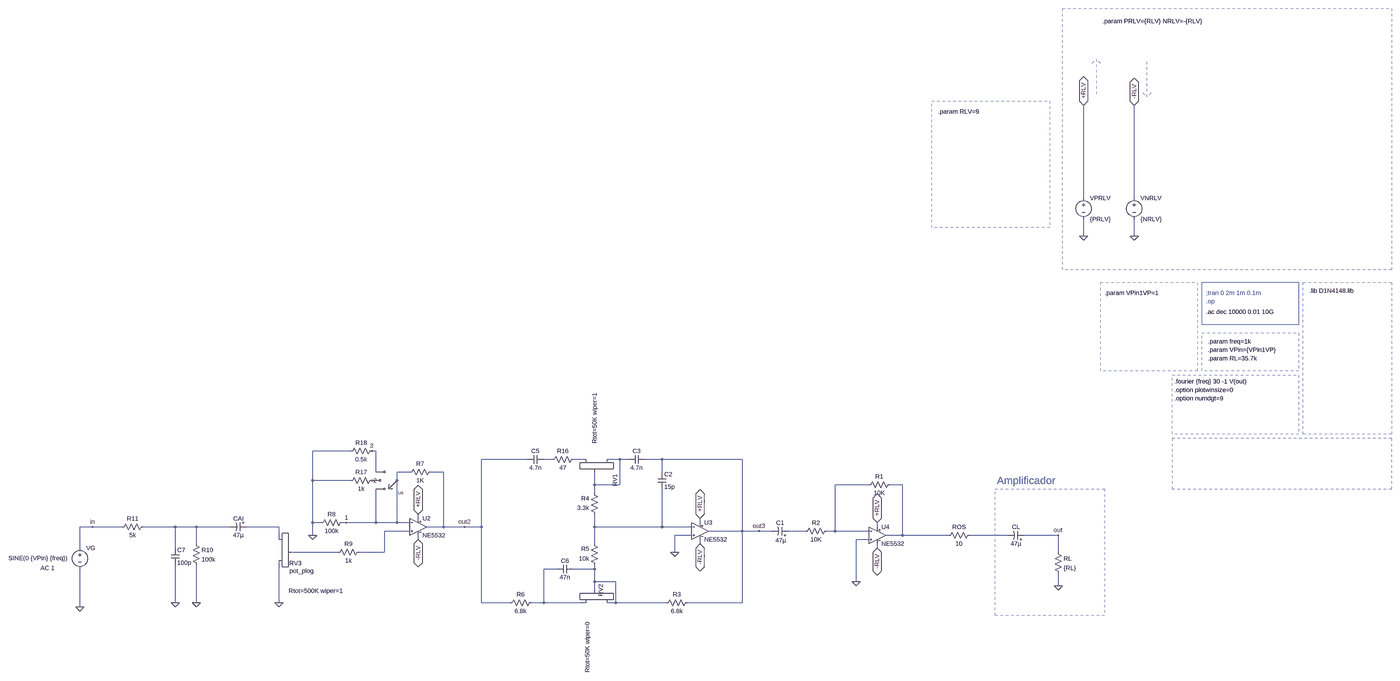
[diagram p0: schematic preamp_V0.4.asc, whole sheet]
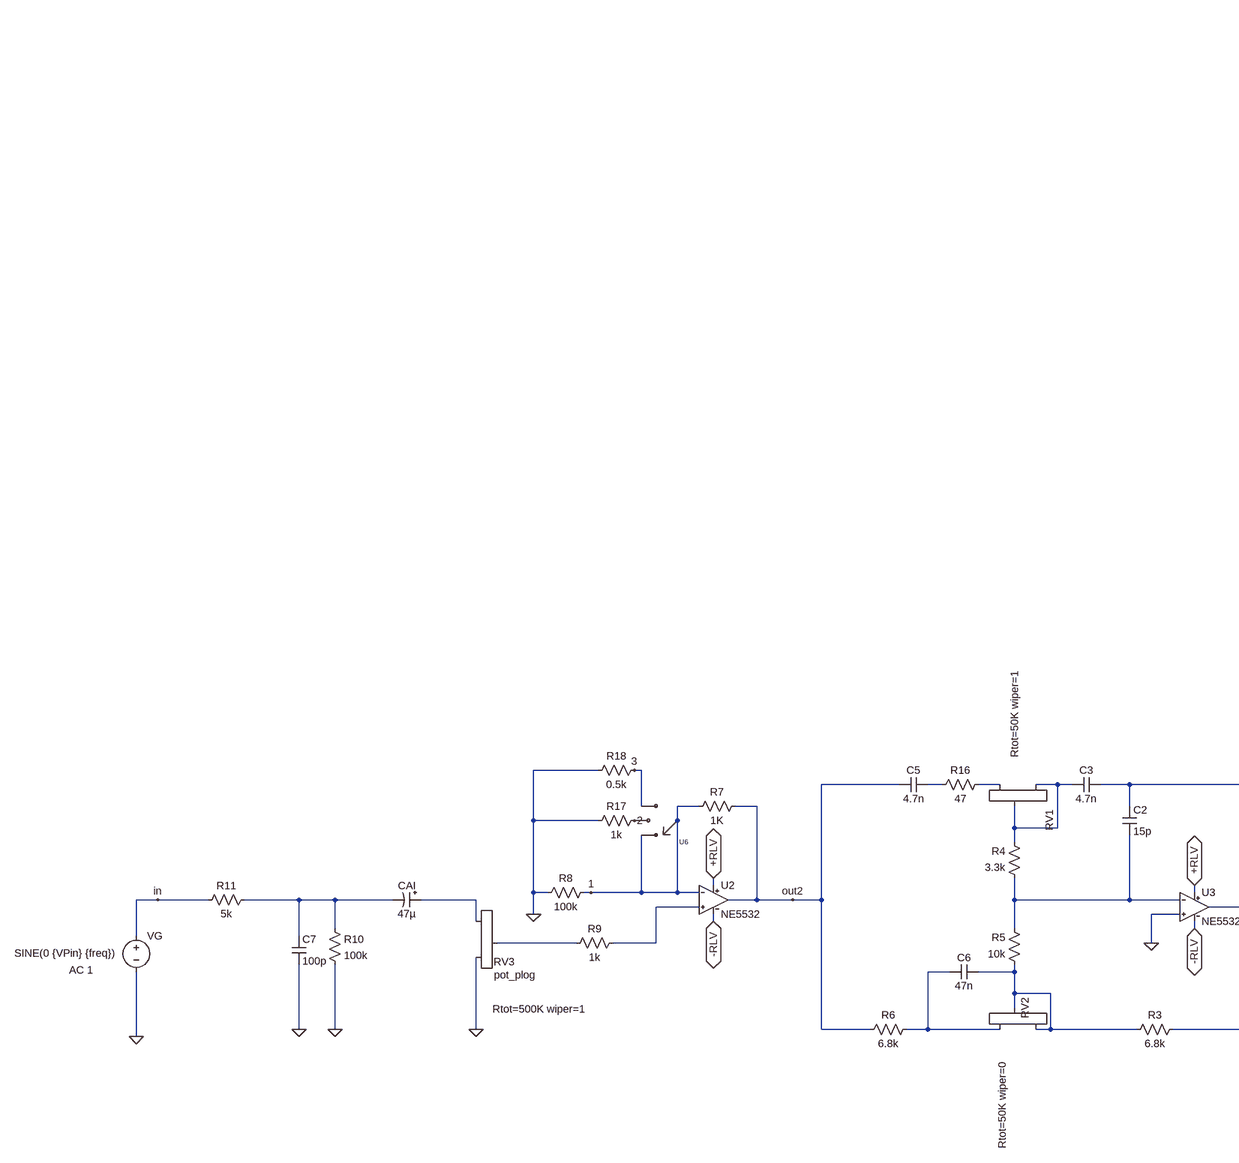
[diagram p1: schematic preamp_V0.4.asc, part, row 1 of 1, column 1 of 2]
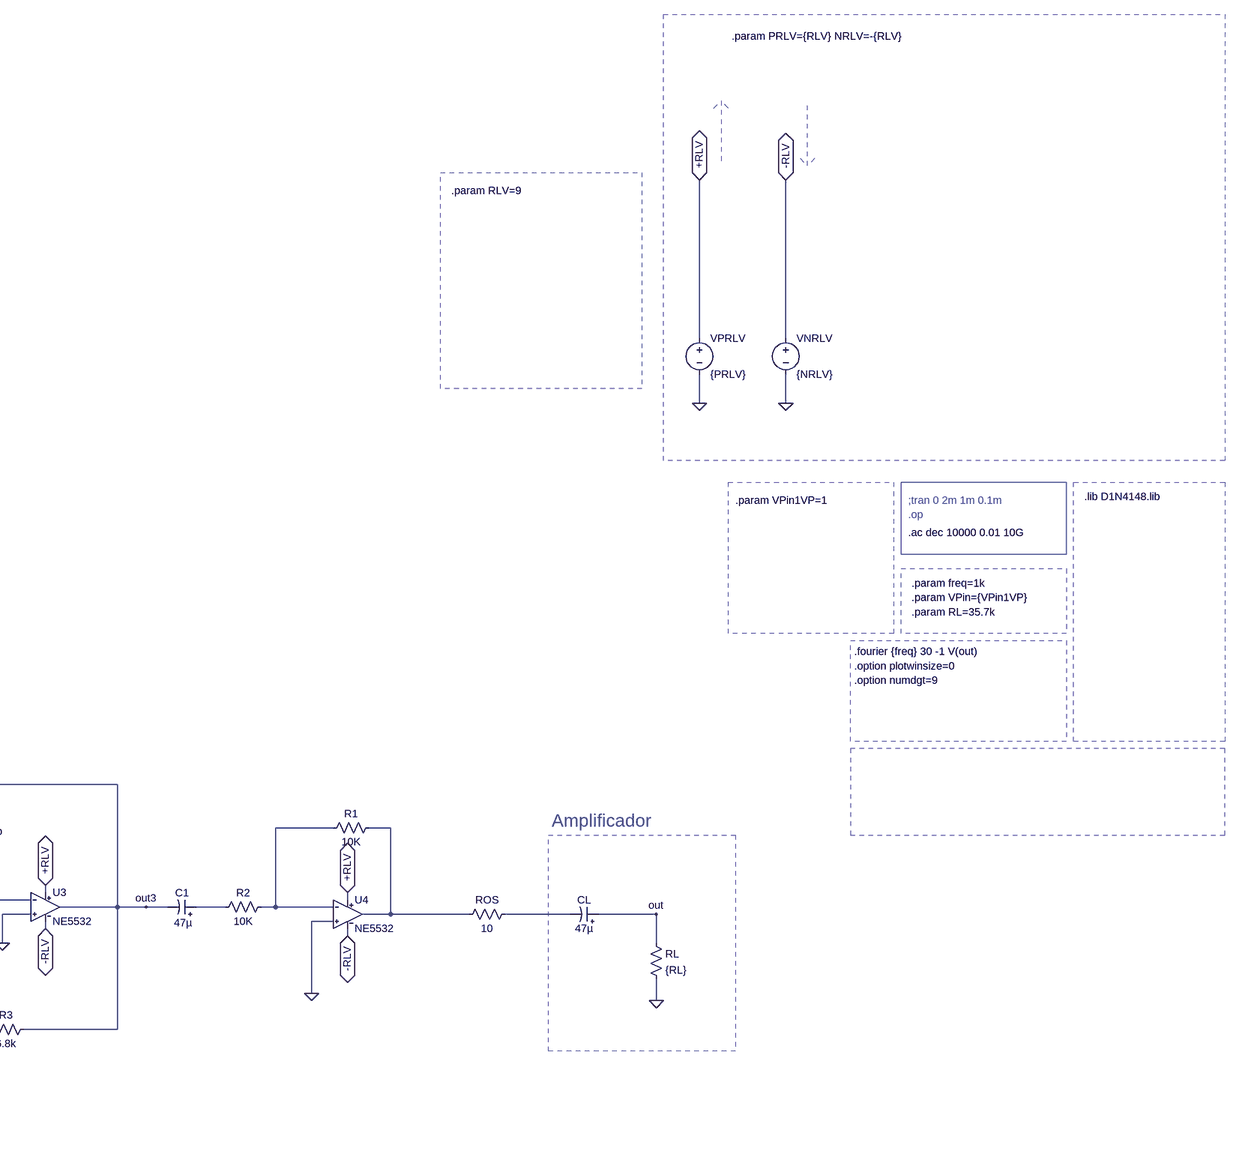
[diagram p2: schematic preamp_V0.4.asc, part, row 1 of 1, column 2 of 2]
preamp_V0.4.asc, the LTspice schematic file:
Version 4
SHEET 1 4212 2620
WIRE 1792 -1328 1792 -1680
WIRE 1984 -1328 1984 -1680
WIRE 1792 -1184 1792 -1248
WIRE 1984 -1184 1984 -1248
WIRE -992 -368 -1136 -368
WIRE -896 -368 -912 -368
WIRE -320 -336 -496 -336
WIRE -224 -336 -256 -336
WIRE -96 -336 -144 -336
WIRE 32 -336 -16 -336
WIRE 64 -336 32 -336
WIRE 192 -336 128 -336
WIRE 496 -336 192 -336
WIRE -896 -288 -896 -368
WIRE -768 -288 -816 -288
WIRE -640 -288 -688 -288
WIRE 192 -288 192 -336
WIRE -1136 -256 -1136 -368
WIRE -992 -256 -1136 -256
WIRE -816 -256 -816 -288
WIRE -64 -240 -64 -288
WIRE 32 -240 32 -336
WIRE 32 -240 -64 -240
WIRE 976 -240 848 -240
WIRE 1104 -240 1056 -240
WIRE -64 -208 -64 -240
WIRE -736 -112 -736 -128
WIRE -1136 -96 -1136 -256
WIRE -1104 -96 -1136 -96
WIRE -1008 -96 -1024 -96
WIRE -896 -96 -896 -224
WIRE -896 -96 -1008 -96
WIRE -816 -96 -816 -256
WIRE -816 -96 -896 -96
WIRE -768 -96 -816 -96
WIRE 336 -96 336 -112
WIRE -2064 -80 -2112 -80
WIRE -1872 -80 -2064 -80
WIRE -1664 -80 -1792 -80
WIRE -1584 -80 -1664 -80
WIRE -1456 -80 -1584 -80
WIRE -1264 -80 -1392 -80
WIRE -640 -80 -640 -288
WIRE -640 -80 -704 -80
WIRE -560 -80 -640 -80
WIRE -496 -80 -496 -336
WIRE -496 -80 -560 -80
WIRE -64 -80 -64 -128
WIRE 192 -80 192 -224
WIRE 192 -80 -64 -80
WIRE 304 -80 192 -80
WIRE 1008 -80 1008 -96
WIRE -768 -64 -864 -64
WIRE 496 -64 496 -336
WIRE 496 -64 368 -64
WIRE 560 -64 496 -64
WIRE 608 -64 560 -64
WIRE 736 -64 672 -64
WIRE 848 -64 848 -240
WIRE 848 -64 816 -64
WIRE 976 -64 848 -64
WIRE -1136 -48 -1136 -96
WIRE 304 -48 240 -48
WIRE 1104 -48 1104 -240
WIRE 1104 -48 1040 -48
WIRE 1280 -48 1104 -48
WIRE 1504 -48 1360 -48
WIRE 1696 -48 1568 -48
WIRE -1264 -32 -1264 -80
WIRE -736 -32 -736 -48
WIRE 976 -32 928 -32
WIRE -1584 -16 -1584 -80
WIRE -64 -16 -64 -80
WIRE 336 -16 336 -32
WIRE -2112 0 -2112 -80
WIRE -1664 0 -1664 -80
WIRE 1008 0 1008 -16
WIRE -1040 16 -1216 16
WIRE -864 16 -864 -64
WIRE -864 16 -960 16
WIRE 240 16 240 -48
WIRE 1696 16 1696 -48
WIRE -208 80 -256 80
WIRE -64 80 -64 64
WIRE -64 80 -144 80
WIRE -64 128 -64 80
WIRE 16 128 -64 128
WIRE 928 128 928 -32
WIRE 1696 144 1696 96
WIRE -64 160 -64 128
WIRE -1664 208 -1664 64
WIRE -1584 208 -1584 64
WIRE -1264 208 -1264 48
WIRE -496 208 -496 -80
WIRE -384 208 -496 208
WIRE -256 208 -256 80
WIRE -256 208 -304 208
WIRE -96 208 -256 208
WIRE 16 208 16 128
WIRE 16 208 -16 208
WIRE 208 208 16 208
WIRE 496 208 496 -64
WIRE 496 208 288 208
WIRE -2112 224 -2112 80
FLAG -2112 224 0
FLAG -2064 -80 in
FLAG 1792 -1184 0
FLAG 1792 -1680 +RLV
IOPIN 1792 -1680 BiDir
FLAG 1984 -1184 0
FLAG 1984 -1680 -RLV
IOPIN 1984 -1680 BiDir
FLAG 928 128 0
FLAG 1008 0 -RLV
IOPIN 1008 0 BiDir
FLAG 1008 -96 +RLV
IOPIN 1008 -96 BiDir
FLAG 1696 144 0
FLAG 1696 -48 out
FLAG -1584 208 0
FLAG -1664 208 0
FLAG -1264 208 0
FLAG -736 -32 -RLV
IOPIN -736 -32 BiDir
FLAG -736 -128 +RLV
IOPIN -736 -128 BiDir
FLAG 336 -16 -RLV
IOPIN 336 -16 BiDir
FLAG 336 -112 +RLV
IOPIN 336 -112 BiDir
FLAG 240 16 0
FLAG -1136 -48 0
FLAG -560 -80 out2
FLAG 560 -64 out3
FLAG -1008 -96 1
FLAG -912 -256 2
FLAG -912 -368 3
DATAFLAG 2032 -1808 "I(Vnrlv)"
DATAFLAG 1840 -1808 "-I(Vprlv)"
DATAFLAG 1200 -48 ""
DATAFLAG 496 -192 ""
SYMBOL voltage -2112 -16 R0
WINDOW 3 -271 55 Left 2
WINDOW 123 -149 92 Left 2
WINDOW 39 0 0 Left 2
SYMATTR Value SINE(0 {VPin} {freq})
SYMATTR Value2 AC 1
SYMATTR InstName VG
SYMBOL polcap -1392 -96 R90
WINDOW 0 0 32 VBottom 2
WINDOW 3 32 32 VTop 2
SYMATTR InstName CAI
SYMATTR Value 47µ
SYMBOL voltage 1792 -1344 R0
SYMATTR InstName VPRLV
SYMATTR Value {PRLV}
SYMBOL voltage 1984 -1344 R0
SYMATTR InstName VNRLV
SYMATTR Value {NRLV}
SYMBOL res 832 -80 R90
WINDOW 0 0 56 VBottom 2
WINDOW 3 32 56 VTop 2
SYMATTR InstName R2
SYMATTR Value 10K
SYMBOL res 1072 -256 R90
WINDOW 0 0 56 VBottom 2
WINDOW 3 32 56 VTop 2
SYMATTR InstName R1
SYMATTR Value 10K
SYMBOL res 1680 0 R0
SYMATTR InstName RL
SYMATTR Value {RL}
SYMBOL NE5532 1008 -112 R0
SYMATTR InstName U4
SYMBOL potentiometer_standard -1280 -48 R0
WINDOW 0 55 106 Left 2
WINDOW 3 53 211 Left 2
WINDOW 39 51 172 Left 2
WINDOW 38 56 135 Left 2
SYMATTR InstName RV3
SYMATTR Value Rtot=500K wiper=1
SYMATTR SpiceModel pot_plog
SYMBOL res -1600 -32 R0
SYMATTR InstName R10
SYMATTR Value 100k
SYMBOL cap -1680 0 R0
SYMATTR InstName C7
SYMATTR Value 100p
SYMBOL NE5532 -736 -144 R0
SYMATTR InstName U2
SYMBOL NE5532 336 -128 R0
SYMATTR InstName U3
SYMBOL potentiometer_standard 0 -352 R90
WINDOW 3 -238 63 Left 2
WINDOW 39 -212 100 Left 2
WINDOW 38 -131 29 Left 2
SYMATTR Value Rtot=50K wiper=1
SYMATTR InstName RV1
SYMBOL cap 176 -288 R0
SYMATTR InstName C2
SYMATTR Value 15p
SYMBOL cap 128 -352 R90
WINDOW 0 0 32 VBottom 2
WINDOW 3 32 32 VTop 2
SYMATTR InstName C3
SYMATTR Value 4.7n
SYMBOL cap -256 -352 R90
WINDOW 0 0 32 VBottom 2
WINDOW 3 32 32 VTop 2
SYMATTR InstName C5
SYMATTR Value 4.7n
SYMBOL cap -144 64 R90
WINDOW 0 0 32 VBottom 2
WINDOW 3 32 32 VTop 2
SYMATTR InstName C6
SYMATTR Value 47n
SYMBOL potentiometer_standard 0 224 M270
WINDOW 3 -249 91 Left 2
WINDOW 39 -224 133 Left 2
WINDOW 38 -138 55 Left 2
WINDOW 0 40 40 Left 2
SYMATTR Value Rtot=50K wiper=0
SYMATTR InstName RV2
SYMBOL res 304 192 R90
WINDOW 0 0 56 VBottom 2
WINDOW 3 32 56 VTop 2
SYMATTR InstName R3
SYMATTR Value 6.8k
SYMBOL res -288 192 R90
WINDOW 0 0 56 VBottom 2
WINDOW 3 32 56 VTop 2
SYMATTR InstName R6
SYMATTR Value 6.8k
SYMBOL res -48 80 R180
WINDOW 0 36 76 Left 2
WINDOW 3 36 40 Left 2
SYMATTR InstName R5
SYMATTR Value 10k
SYMBOL res -48 -112 R180
WINDOW 0 36 76 Left 2
WINDOW 3 36 40 Left 2
SYMATTR InstName R4
SYMATTR Value 3.3k
SYMBOL res -672 -304 R90
WINDOW 0 0 56 VBottom 2
WINDOW 3 32 56 VTop 2
SYMATTR InstName R7
SYMATTR Value 1K
SYMBOL res -1008 -112 R90
WINDOW 0 0 56 VBottom 2
WINDOW 3 32 56 VTop 2
SYMATTR InstName R8
SYMATTR Value 100k
SYMBOL res -1776 -96 R90
WINDOW 0 0 56 VBottom 2
WINDOW 3 32 56 VTop 2
SYMATTR InstName R11
SYMATTR Value 5k
SYMBOL res 1376 -64 R90
WINDOW 0 0 56 VBottom 2
WINDOW 3 32 56 VTop 2
SYMATTR InstName ROS
SYMATTR Value 10
SYMBOL polcap 1568 -32 M270
WINDOW 0 32 32 VTop 2
WINDOW 3 0 32 VBottom 2
SYMATTR InstName CL
SYMATTR Value 47µ
SYMBOL res -944 0 R90
WINDOW 0 0 56 VBottom 2
WINDOW 3 32 56 VTop 2
SYMATTR InstName R9
SYMATTR Value 1k
SYMBOL polcap 672 -48 M270
WINDOW 0 32 32 VTop 2
WINDOW 3 -4 30 VBottom 2
SYMATTR InstName C1
SYMATTR Value 47µ
SYMBOL res -128 -352 R90
WINDOW 0 0 56 VBottom 2
WINDOW 3 32 56 VTop 2
SYMATTR InstName R16
SYMATTR Value 47
SYMBOL 1P3T -864 -256 M180
SYMATTR InstName U6
SYMATTR Value SET=3
SYMBOL res -896 -272 R90
WINDOW 0 0 56 VBottom 2
WINDOW 3 32 56 VTop 2
SYMATTR InstName R17
SYMATTR Value 1k
SYMBOL res -896 -384 R90
WINDOW 0 0 56 VBottom 2
WINDOW 3 32 56 VTop 2
SYMATTR InstName R18
SYMATTR Value 0.5k
TEXT 2256 -968 Left 2 ;;tran 0 2m 1m 0.1m
TEXT 2264 -784 Left 2 !.param freq=1k
TEXT 2256 -936 Left 2 ;.op
TEXT 2136 -632 Left 2 !.fourier {freq} 30 -1 V(out)
TEXT 2256 -896 Left 2 !.ac dec 10000 0.01 10G
TEXT 2264 -752 Left 2 !.param VPin={VPin1VP}
TEXT 2136 -600 Left 2 !.option plotwinsize=0
TEXT 2136 -568 Left 2 !.option numdgt=9
TEXT 2264 -720 Left 2 !.param RL=35.7k
TEXT 1240 -1656 Left 2 !.param RLV=9
TEXT 1864 -2000 Left 2 !.param PRLV={RLV} NRLV=-{RLV}
TEXT 1872 -968 Left 2 !.param VPin1VP=1
TEXT 2648 -976 Left 2 !.lib D1N4148.lib
TEXT 1464 -256 Left 4 ;Amplificador
LINE Normal 2032 -1712 2032 -1856 2
LINE Normal 2032 -1712 2032 -1712 2
LINE Normal 2032 -1712 2032 -1712 2
LINE Normal 2016 -1728 2032 -1712 2
LINE Normal 2016 -1728 2016 -1728 2
LINE Normal 2048 -1728 2032 -1712 2
LINE Normal 1840 -1856 1840 -1712 2
LINE Normal 1840 -1856 1840 -1856 2
LINE Normal 1840 -1856 1840 -1856 2
LINE Normal 1856 -1840 1840 -1856 2
LINE Normal 1856 -1840 1856 -1840 2
LINE Normal 1824 -1840 1840 -1856 2
RECTANGLE Normal 2608 -848 2240 -1008
RECTANGLE Normal 2608 -672 2240 -816 3
RECTANGLE Normal 2960 -432 2624 -1008 2
RECTANGLE Normal 2608 -432 2128 -656 3
RECTANGLE Normal 2128 -224 2960 -416 3
RECTANGLE Normal 2960 -1056 1712 -2048 4
RECTANGLE Normal 1664 -1216 1216 -1696 2
RECTANGLE Normal 2224 -672 1856 -1008 3
RECTANGLE Normal 1872 256 1456 -224 2

The netlist it stands for:
* preamp_V0.4.asc
VG in 0 SINE(0 {VPin} {freq}) AC 1
CAI N007 N006 47µ
VPRLV +RLV 0 {PRLV}
VNRLV -RLV 0 {NRLV}
R2 N004 N010 10K
R1 N005 N004 10K
RL out 0 {RL}
XU4 0 N004 +RLV -RLV N005 NE5532 NE5532  ; pins In+ In- V+ V- OUT
XRV3 N007 0 N012 pot_plog Rtot=500K wiper=1
R10 N006 0 100k
C7 N006 0 100p
XU2 N009 1 +RLV -RLV out2 NE5532 NE5532  ; pins In+ In- V+ V- OUT
XU3 0 N008 +RLV -RLV out3 NE5532 NE5532  ; pins In+ In- V+ V- OUT
XRV1 N003 N002 N003 Rtot=50K wiper=1
C2 out3 N008 15p
C3 out3 N003 4.7n
C5 N001 out2 4.7n
C6 N014 N013 47n
XRV2 N014 N013 N014 Rtot=50K wiper=0
R3 out3 N014 6.8k
R6 N013 out2 6.8k
R5 N014 N008 10k
R4 N008 N003 3.3k
R7 out2 1 1K
R8 1 0 100k
R11 N006 in 5k
ROS N011 N005 10
CL out N011 47µ
R9 N009 N012 1k
C1 N010 out3 47µ
R16 N002 N001 47
XU6 1 1 2 3 1p3t SET=3
R17 2 0 1k
R18 3 0 0.5k
* ;tran 0 2m 1m 0.1m
.param freq=1k
* .op
.fourier {freq} 30 -1 V(out)
.ac dec 10000 0.01 10G
.param VPin={VPin1VP}
.option plotwinsize=0
.option numdgt=9
.param RL=35.7k
.param RLV=9
.param PRLV={RLV} NRLV=-{RLV}
.param VPin1VP=1
.lib D1N4148.lib
* Amplificador
.lib NE5532.mod
.lib 1P3T.mod
.backanno
.end